# Altium schematic sheet Power.SchDoc
size 297 x 209 mm; SheetNumber: 3; SheetTotal: 5
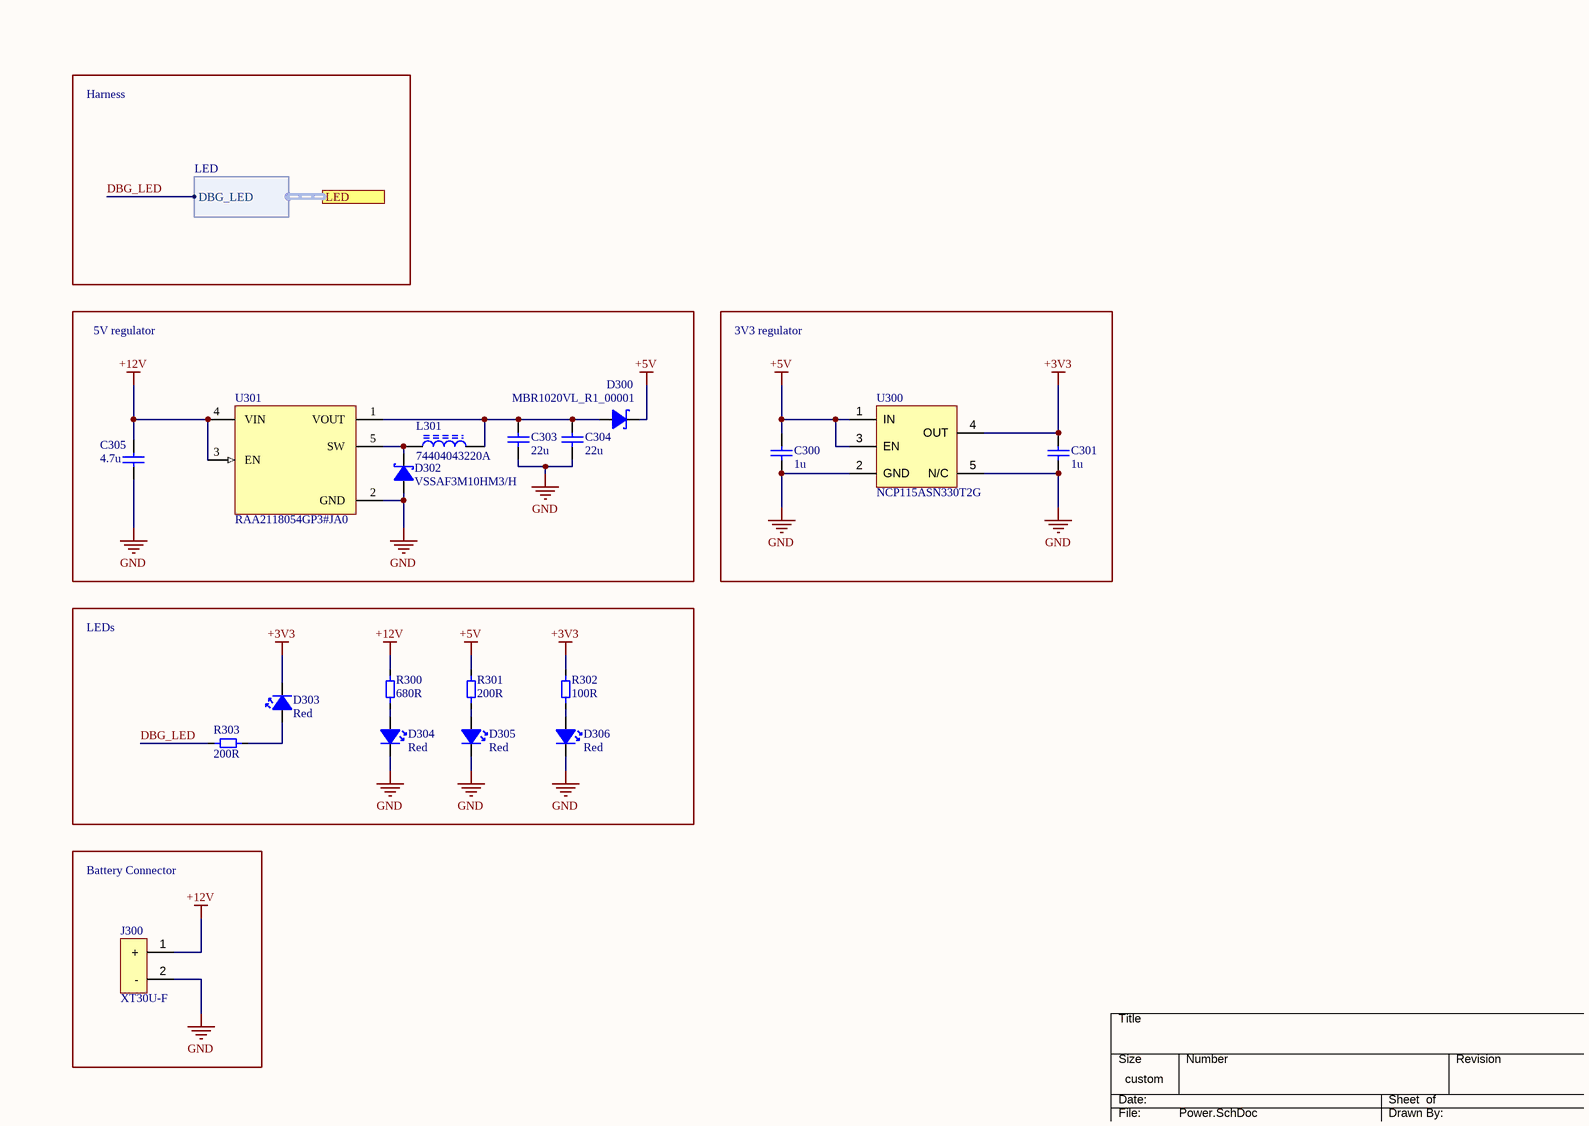
[diagram p0: Power.SchDoc]

## Parts
C300  1u  [MLCC_0603_M]
C301  1u  [MLCC_0603_M]
C303  22u  [MLCC_0603_M]
C304  22u  [MLCC_0603_M]
C305  4.7u  [MLCC_1206_M]
D300  MBR1020VL_R1_00001  [FP-MBR1020VL_R1_00001-MFG]
D302  VSSAF3M10HM3/H  [VSSAF3M10HM3_H-Footprint-1]
D303  Red  [0603 RED LED]
D304  Red  [0603 RED LED]
D305  Red  [0603 RED LED]
D306  Red  [0603 RED LED]
J300  XT30U-F  [XT30U-F]
L301  74404043220A  [WE-LQS_4025]
R300  680R  [Resistor_0603_M]
R301  200R  [Resistor_0603_M]
R302  100R  [Resistor_0603_M]
R303  200R  [Resistor_0603_M]
U300  NCP115ASN330T2G  [TSOP-5]
U301  RAA2118054GP3#JA0  [P5_064B_MFG]

## Blocks framed on the sheet
5V regulator: C303-C305 D300 D302 L301 U301
3V3 regulator: C300 C301 U300
LEDs: D303-D306 R300-R303
Battery Connector: J300

## Ports
LED (harness LED, see Overview[4B], MCU_USB[2B])

## Harnesses
LED: DBG_LED

## Nets
+3V3: C301.2 D303.1(C) R302.2 U300.4(OUT)
+5V: C300.2 D300.1(C) R301.1 U300.1(IN) U300.3(EN)
+12V: C305.2 J300.1(+) R300.2 U301.3(EN) U301.4(VIN)
GND: C300.1 C301.1 C303.1 C304.1 C305.1 D302.2(A) D304.1(C) D305.1(C) D306.1(C) J300.2(-) U300.2(GND) U300.5(N/C) U301.2(GND)
DBG_LED: R303.1 ; port LED.DBG_LED
NetC303_2: C303.2 C304.2 D300.2(A) L301.2 U301.1(VOUT)
NetD302_1: D302.1(C) L301.1 U301.5(SW)
NetD303_2: D303.2(A) R303.2
NetD304_2: D304.2(A) R300.1
NetD305_2: D305.2(A) R301.2
NetD306_2: D306.2(A) R302.1

## Notes on the sheet
- Harness
- THIS DOCUMENT AND THE DATA DISCLOSED HEREIN OR
- HEREWITH IS THE PROPERTY OF ALTIUM LIMITED AND MAY
- DWG NO:
- REVISION
- REV:
- DESCRIPTION
- DATE
- APPROVED
- BE FREELY DISTRIBUTED IN WHOLE. NO RIGHTS ARE
- RESERVED OR EXPRESS OR IMPLIED WARANTEE GIVEN.
- ENG:
- APPROVALS
- PROJECT
- DSN:
- CHK:
- REFERENCE DOCUMENTS
- PROJECT REVISION:
- TITLE
- DOCUMENT REVISION:
- DESIGN ITEM:
- BOM:
- FAB DWG:
- PCB DWG:
- ASSY DWG:
- SCALE:
- A3
- SIZE
- CAGE CODE
- FILE NAME
- DWG NO.
- SHEET
- OF
- REV

## Library data of the parts
C300 C301 = CMP-001-0565-1: MLCC, 0603, 1u, 10%, 50V, X5R; Manufacturer: Any; Capacitor Type: Ceramic; Value: 1µF; Part number: MLCC, 0603, 1u, 10%, 50V, X5R; Dielectric: X5R; Voltage: 50V; RoHS: Yes; Tolerance: 10%; Mount: SMD; Case/Package: 0603
C303 C304 = CMP-001-1264-1: MLCC, 0603, 22u, 10%, 16V, X5R; Manufacturer: Any; Value: 22µF; Capacitor Type: Ceramic; Tolerance: 10%; Case/Package: 0603; Dielectric: X5R; Part number: MLCC, 0603, 22u, 10%, 16V, X5R; Mount: SMD; RoHS: Yes; Voltage: 16V
C305 = CMP-001-1124-2: MLCC, 1206, 4.7u, 10%, 35V, X5R; Manufacturer: Any; Capacitor Type: Ceramic; Value: 4,7µF; RoHS: Yes; Part number: MLCC, 1206, 4.7u, 10%, 35V, X5R; Voltage: 35V; Tolerance: 10%; Case/Package: 1206; Dielectric: X5R; Mount: SMD
D300 = CMP-ROOT-01310-1: Rectifier Diode, Schottky, 1 Phase, 1 Element, 1A, 20V V(RRM), Silicon; Manufacturer: Panjit; Max Forward Surge Current (Ifsm): 45A; Max Junction Temperature (Tj): 125°C; Number of Elements: 1; Peak Reverse Current: 600µA; Case/Package: SOD-123FL; Mount: SMD; Part number: MBR1020VL_R1_00001; Pins: 2; RoHS: Compliant; Forward Current: 1A; Height: 1.1mm; Lifecycle Status: Production; Max Operating Temperature: 125°C; Max Output current: 1A; Max Repetitive Reverse Voltage (Vrrm): 20V; Min Operating Temperature: -55°C; Number of Terminals: 2; REACH SVHC: No; Reverse Standoff Voltage: 20V
D302 = CMP-ROOT-01308-1: Rectifier Diode, Schottky, 1 Phase, 1 Element, 2.3A, 100V V(RRM), Silicon, DO-221AC; Forward Voltage: 720mV; Max Forward Surge Current (Ifsm): 80A; Number of Elements: 1; Peak Reverse Current: 200µA; Case/Package: DO-221AC-2; Manufacturer: VSSAF3M10HM3/H; Mount: SMD; Part number: VSSAF3M10HM3/H; Pins: 2; RoHS: Compliant; Lifecycle Status: Production; Max Operating Temperature: 175°C; Max Output current: 2.3A; Min Operating Temperature: -40°C; Number of Terminals: 2; REACH SVHC: No; Reverse Standoff Voltage: 100V
D303-D306 = CMP-ROOT-00025-2: Generic red 0603 LED; Part number: Any Red 0603 LED; Manufacturer: Any; Color: Red; Case/Package: 0603; Mount: SMD; RoHS: Yes
J300 = CMP-ROOT-01262-3: Power Connector; Manufacturer: AMASS; Case/Package: Non-standard; Mount: SMD; Part number: XT30U-F; Pins: 2; RoHS: Yes; Color: Yellow; Contact Material: Brass; Orientation: Straight
L301 = CMP-ROOT-01309-1: General Purpose Inductor, 22uH, 20%, 1 Element, Nickel-zinc Ferrite-Core, SMD, 1616; Manufacturer: Wurth Elektronik; Value: 22µH; Current Rating: 1.11A; DC Resistance (DCR): 200mΩ; Case/Package: 4mm x 4mm; Mount: SMD; Part number: 74404043220A; Pins: 2; RoHS: Compliant; Ambient Temperature Range High: 85°C; Ambient Temperature Range Low: -40°C; Height: 2.5mm; Inductance Tolerance: 20%; Length: 4mm; Max Operating Temperature: 125°C; Min Operating Temperature: -40°C; Width: 4mm
R300 = CMP-001-0074-3: Resistor, 0603, 680R, 1%, 1/10W; Manufacturer: Any; Power: 100mW; Value: 680; RoHS: Yes; Tolerance: 1%; Mount: SMD; Part number: Resistor, 0603, 680R, 1%, 1/10W; Case/Package: 0603
R301 R303 = CMP-001-0060-2: Resistor, 0603, 200R, 1%, 1/10W; Manufacturer: Any; Value: 200; Power: 100mW; RoHS: Yes; Part number: Resistor, 0603, 200R, 1%, 1/10W; Mount: SMD; Tolerance: 1%; Case/Package: 0603
R302 = CMP-0001-00262-1: Resistor, 0603, 100R, ≤5%, ≥1/16W; Manufacturer: Any; Value: 100; Case/Package: 0603; Mount: SMD; Part number: Resistor, 0603, 100R, ≤5%, ≥1/16W; RoHS: Yes
U300 = CMP-00026-1: LDO Regulator, 300 mA, Low Iq, High PSRR, High Accuracy 3.3V, TSOP5, Active Discharge, Normal Vout Slew-Rate; Manufacturer: onsemi; Accuracy: 1%; Dropout Voltage: 235mV; Max Supply Voltage: 5.5V; Max Junction Temperature (Tj): 85°C; Min Input Voltage: 3.8V; Min Supply Voltage: 1.7V; Nominal Supply Current: 50µA; Number of Channels: 1; Output Current: 300mA; Output Type: Fixed; Voltage Tolerance: 2%; China RoHS: Compliant; Height: 1.1mm; Height - Seated (Max): 1.1mm; Length: 3mm; Lifecycle Status: Production; Manufacturer Lifecycle Status: ACTIVE; Max Operating Temperature: 150°C; Number of Circuits: 1; Number of Outputs: 1; Number of Terminals: 5; Output Voltage: 3.3V; REACH SVHC: Yes; RoHS: Compliant; Schedule B: 8542390000, 8542390000; Terminal Pitch: 950µm; Width: 1.5mm; Case/Package: TSOP-5; Mount: SMD; Part number: NCP115ASN330T2G
U301 = CMP-00019-3: Switching Regulator, Current-mode, 0.3A, 230kHz Switching Freq-Max, PDSO5; Manufacturer Lifecycle Status: ACTIVE; Manufacturer: Renesas / Intersil; Max Supply Voltage: 80V; Max Junction Temperature (Tj): 125°C; Max Output current: 300mA; Max Output Voltage: 5.15V; Min Input Voltage: 7V; Min Output Voltage: 3.18V; Nominal Supply Voltage: 18V; Nominal Output Voltage: 5V; Number of Circuits: 1; Pitch: 1mm; Topology: Buck; Case/Package: TSOT; Export Control Classification Number (ECCN) Code: EAR99; Harmonized Tariff Schedule (HTS) Code: 8540000000; Height: 850µm; Height - Seated (Max): 1.1mm; Length: 2.9mm; Lifecycle Status: Production; MSL: 3; Max Operating Temperature: 125°C; Max Switching Frequency: 230kHz; Min Operating Temperature: -40°C; Mounting Technology: Surface Mount; Pins: 5; Number of Terminals: 5; Package Quantity: 3000; Part Family: RAA211805; REACH SVHC: Yes; RoHS: Compliant; Terminal Pitch: 950µm; Width: 1.6mm; Mount: SMD; Part number: RAA2118054GP3#JA0